# Altium schematic sheet galvo_driver.SchDoc
size A
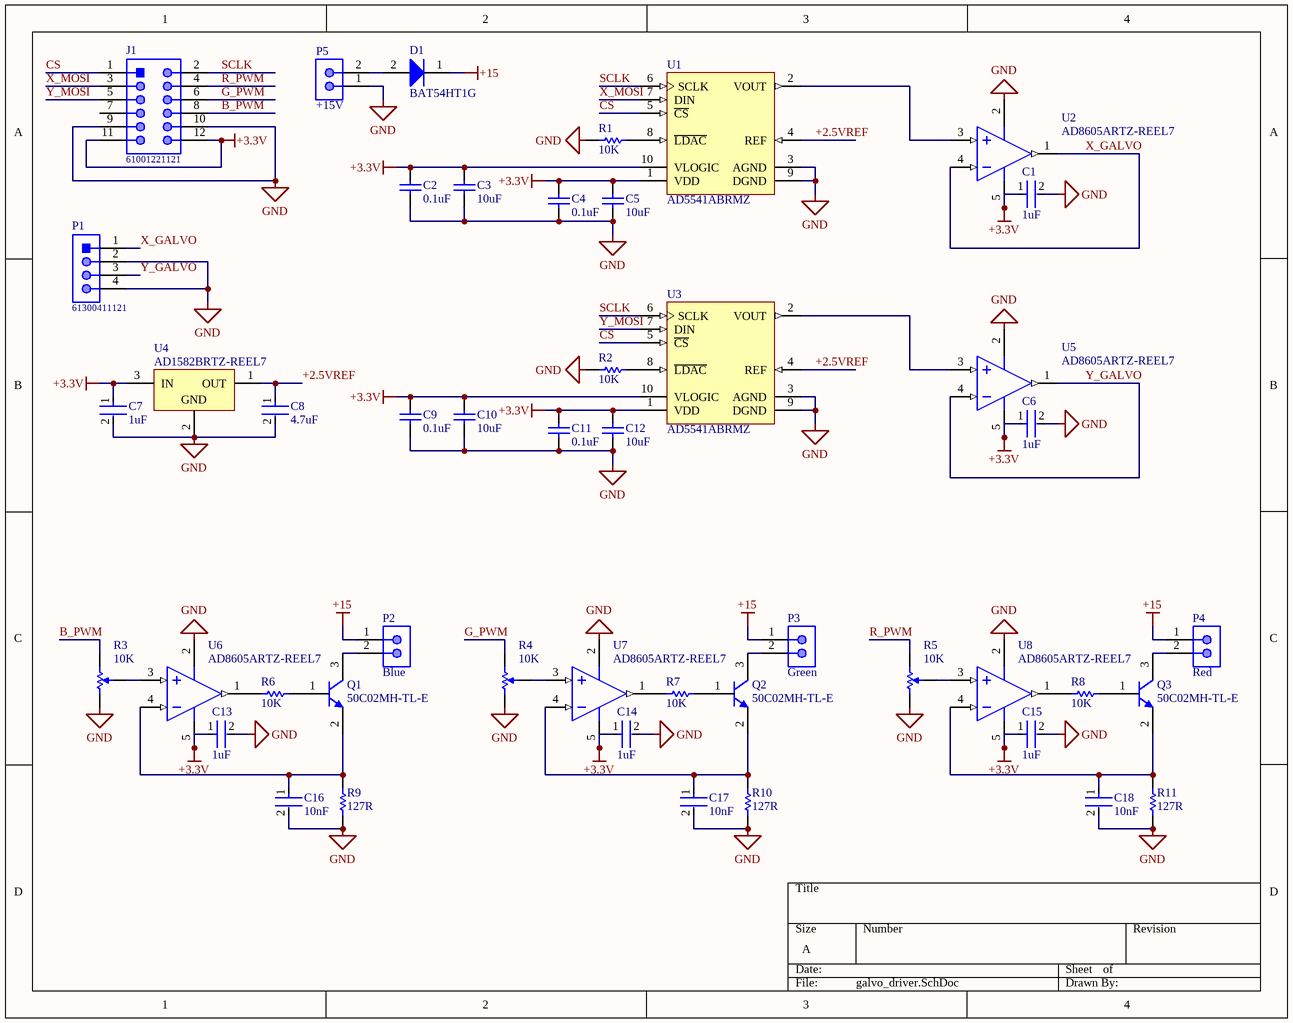
[diagram p0: galvo_driver.SchDoc]

## Parts
C1  1uF  [FP-CC0603-DA-MFG]
C2  0.1uF  [CAPC1608X87X35NL15T15]
C3  10uF  [CAPC1608X90X35NL10T15]
C4  0.1uF  [CAPC1608X87X35NL15T15]
C5  10uF  [CAPC1608X90X35NL10T15]
C6  1uF  [FP-CC0603-DA-MFG]
C7  1uF  [FP-CC0603-DA-MFG]
C8  4.7uF  [FP-C0603-CG-MFG]
C9  0.1uF  [CAPC1608X87X35NL15T15]
C10  10uF  [CAPC1608X90X35NL10T15]
C11  0.1uF  [CAPC1608X87X35NL15T15]
C12  10uF  [CAPC1608X90X35NL10T15]
C13  1uF  [FP-CC0603-DA-MFG]
C14  1uF  [FP-CC0603-DA-MFG]
C15  1uF  [FP-CC0603-DA-MFG]
C16  10nF  [FP-CGA3E-0_3-0_1-IPC_A]
C17  10nF  [FP-CGA3E-0_3-0_1-IPC_A]
C18  10nF  [FP-CGA3E-0_3-0_1-IPC_A]
D1  BAT54HT1G  [ONSC-SOD-323-2-477-02_V]
J1  61001221121  [61001221121]
P1  61300411121  [61300411121]
P2  Blue  [JST-B2B-XH-A_V]
P3  Green  [JST-B2B-XH-A_V]
P4  Red  [JST-B2B-XH-A_V]
P5  +15V  [JST-B2B-XH-A_V]
Q1  50C02MH-TL-E  [ONSC-MCPH-3_V]
Q2  50C02MH-TL-E  [ONSC-MCPH-3_V]
Q3  50C02MH-TL-E  [ONSC-MCPH-3_V]
R1  10K  [RESC1609X55X30LL15T15]
R2  10K  [RESC1609X55X30LL15T15]
R3  10K  [BOUR-3313J-1_V]
R4  10K  [BOUR-3313J-1_V]
R5  10K  [BOUR-3313J-1_V]
R6  10K  [RESC1609X55X30LL15T15]
R7  10K  [RESC1609X55X30LL15T15]
R8  10K  [RESC1609X55X30LL15T15]
R9  127R  [RESC1608X55X30LL15T15]
R10  127R  [RESC1608X55X30LL15T15]
R11  127R  [RESC1608X55X30LL15T15]
U1  AD5541ABRMZ  [RM-10_L]
U2  AD8605ARTZ-REEL7  [ADI-RJ-5_M]
U3  AD5541ABRMZ  [RM-10_L]
U4  AD1582BRTZ-REEL7  [ADI-RT-3_M]
U5  AD8605ARTZ-REEL7  [ADI-RJ-5_M]
U6  AD8605ARTZ-REEL7  [ADI-RJ-5_M]
U7  AD8605ARTZ-REEL7  [ADI-RJ-5_M]
U8  AD8605ARTZ-REEL7  [ADI-RJ-5_M]

## Nets
+3.3V: C1.1 C2.1 C3.2 C4.1 C5.2 C6.1 C7.1 C9.1 C10.2 C11.1 C12.2 C13.1 C14.1 C15.1 J1.11 J1.12 U1.1(VDD) U1.10(VLOGIC) U2.5(+V) U3.1(VDD) U3.10(VLOGIC) U4.3(IN) U5.5(+V) U6.5(+V) U7.5(+V) U8.5(+V)
+15: D1.1(K) P2.1 P3.1 P4.1
GND: C1.2 C2.2 C3.1 C4.2 C5.1 C6.2 C7.2 C8.2 C9.2 C10.1 C11.2 C12.1 C13.2 C14.2 C15.2 C16.2 C17.2 C18.2 J1.9 J1.10 P1.2 P1.4 P5.1 R1.2 R2.2 R3.1 R4.1 R5.1 R9.1 R10.1 R11.1 U1.3(AGND) U1.9(DGND) U2.2(-V) U3.3(AGND) U3.9(DGND) U4.2(GND) U5.2(-V) U6.2(-V) U7.2(-V) U8.2(-V)
+2.5VREF: C8.1 U1.4(REF) U3.4(REF) U4.1(OUT)
B_PWM: J1.8 R3.3
CS: J1.1 U1.5(~{CS}) U3.5(~{CS})
G_PWM: J1.6 R4.3
R_PWM: J1.4 R5.3
SCLK: J1.2 U1.6(SCLK) U3.6(SCLK)
X_GALVO: P1.1 U2.1(OUT) U2.4(-IN)
X_MOSI: J1.3 U1.7(DIN)
Y_GALVO: P1.3 U5.1(OUT) U5.4(-IN)
Y_MOSI: J1.5 U3.7(DIN)
NetC16_1: C16.1 Q1.2(E) R9.2 U6.4(-IN)
NetC17_1: C17.1 Q2.2(E) R10.2 U7.4(-IN)
NetC18_1: C18.1 Q3.2(E) R11.2 U8.4(-IN)
NetD1_2: D1.2(A) P5.2
NetP2_2: P2.2 Q1.3(C)
NetP3_2: P3.2 Q2.3(C)
NetP4_2: P4.2 Q3.3(C)
NetQ1_1: Q1.1(B) R6.2
NetQ2_1: Q2.1(B) R7.2
NetQ3_1: Q3.1(B) R8.2
NetR1_1: R1.1 U1.8(~{LDAC})
NetR2_1: R2.1 U3.8(~{LDAC})
NetR3_2: R3.2 U6.3(+IN)
NetR4_2: R4.2 U7.3(+IN)
NetR5_2: R5.2 U8.3(+IN)
NetR6_1: R6.1 U6.1(OUT)
NetR7_1: R7.1 U7.1(OUT)
NetR8_1: R8.1 U8.1(OUT)
NetU1_2: U1.2(VOUT) U2.3(+IN)
NetU3_2: U3.2(VOUT) U5.3(+IN)

Not connected (* = marked no-connect by the designer): J1 7

## Library data of the parts
C1 C6 C7 C13-C15 = CMP-03422-000924-1: CAP CER 1UF 16V X7R 0603; Manufacturer: YAGEO; Manufacturer Part Number: CC0603KRX7R7BB105; Tolerance: 0.1; Temperature Coefficient: 15%; Material: Ceramic; Package: CC0603-DA; RoHS: TRUE; Device Class L2: Capacitors; Temperature Characteristic: X7R; Temperature: -55°C to +125°C; Temperature Range Low: -55°C; Automotive: No; ComponentLink2Description: Datasheet; Value: 1 uF; Lead Free: Yes; Capacitance: 1 uF; ComponentLink2URL: http://www.yageo.com/documents/recent/UPY-GPHC_X7R_6.3V-to-50V_18.pdf; Device Class L1: Passive Components; Voltage: 16 V; Octopart: https://octopart.com/cc0603krx7r7bb105-yageo-42271928; Category: Cap; Digikey Description: CAP CER 1UF 16V X7R 0603; Footprint Url: http://www.yageo.com/exep/pages/download/literatures/UPY-C_GEN_24.pdf; Height: 0.9mm; Voltage Rating: 16 V; Temperature Range High: +125°C; Mouser Description: Multilayer Ceramic Capacitor, CC Series, 1 - F, - 10%, X7R, 16 V, 0603 [1608 Metric]; Device Class L3: Ceramic Capacitors
C2 C4 C9 C11 = CMP-2006-03300-1: C0603X104K5RACTU; Manufacturer: Kemet; Part Number: C0603X104K5RACTU
C3 C5 C10 C12 = CMP-2006-02792-1: GRM188R60J106ME47D; Manufacturer: Murata; Part Number: GRM188R60J106ME47D
C8 = CMP-03020-024641-1: CAP CER 4.7UF 6.3V X5R 0603; Manufacturer: Kemet; Manufacturer Part Number: C0603C475K9PACTU; Temperature Coefficient: 15%; Tolerance: 10%; Material: Ceramic; Device Class L3: Ceramic Capacitors; RoHS: TRUE; Value: 4.7uF; Lead Free: Yes; ComponentLink2Description: Datasheet; Mouser Description: Multilayer Ceramic Capacitors MLCC - SMD/SMT 6.3volts 4.7uF X5R 10%; Package: C0603-CG; Digikey Description: CAP CER 4.7UF 6.3V X5R 0603; ComponentLink2URL: https://content.kemet.com/datasheets/KEM_C1006_X5R_SMD.pdf; Category: Cap; Temperature Range Low: -55°C; Capacitance: 4.7uF; Temperature: -55°C to +85°C; Octopart: https://octopart.com/c0603c475k9pactu-kemet-104242; Ipc Land Pattern Name: CAPC16080X80; Voltage Rating: 6.3V; Temperature Range High: +85°C; Height: 0.9mm; Temperature Characteristic: X5R; Device Class L1: Passive Components; Automotive: No; Device Class L2: Capacitors
C16-C18 = CMP-08246-000769-1: Cap Ceramic 10nF 100V X8R 10% Pad SMD 0603 +150°C Automotive T/R; Mount: Surface Mount; Voltage Rating (DC): 100V; Termination: SMD/SMT; Dielectric: X8R; Case/Package: 0603; Ratings: AEC-Q200; Voltage Rating: 100V; Capacitance: 10nF; Packaging: Tape and Reel; Thickness: 0.035inch; Composition: Ceramic; Max Operating Temperature: 150°C; Width: 0.031inch; Height: 0.8mm; Weight: 7.1E-05oz; Depth: 0.8mm; Min Operating Temperature: -55°C; Length: 1.6mm; Case Code (Metric): 1608; Tolerance: 10%; Package Quantity: 4000; Case Code (Imperial): 0603
D1 = CMP-1055-00462-1: Schottky Barrier Diode, 2-Pin SOD-323, Pb-Free, Tape and Reel; Manufacturer: On Semiconductor; Configuration: Single; trr Max (ns): 5; IFSM Max (A): 0.6; ComponentLink3URL: http://www.onsemi.com/pub_link/Collateral/477-02.PDF.1; PackageDescription: 2-Pin SOD, Body 1.7 x 1.25 mm; ComponentLink2URL: http://www.onsemi.cn/pub_link/Collateral/BAT54HT1-D.PDF; ComponentLink3Description: Package Specification; ComponentLink2Description: Datasheet; DatasheetVersion: Rev. 6; PackageReference: SOD-323-2-477-02; RoHS: TRUE; ComponentLink1URL: http://www.onsemi.com/; Packing: Tape and Reel; PartNumber: BAT54HT1G; Mounting Technology: Surface Mount; ComponentLink1Description: Manufacturer URL; PackageVersion: Rev. H, 03/2007
J1 = CMP-1502-01029-1: SMT Vertical Pin Header WR-PHD, Pitch 2.54 mm, Dual Row, 12 pins; Manufacturer: Wurth Elektronik; Working Voltage: 250VAC; Pin Number: 12; Withstanding Voltage: 500VAC; Contact Resistance: 20mOhm; Rated Current: 3A; Gender: Male; Pitch: 2.54mm; Publisher: WurthElektronik; Packaging: Tube; Part Number: 61001221121; Row Number: Dual; Mounting Technology: SMT; Manufacturer URL: http://www.we-online.de; Operating Temperature: -40to125degC; Datasheet URL: https://katalog.we-online.de/em/datasheet/6100xx21121.pdf; Orientation: Vertical; Package Reference: 61001221121
P1 = CMP-1502-01064-1: THT Vertical Pin Header WR-PHD, Pitch 2.54 mm, Single Row, 4 pins; Manufacturer: Wurth Elektronik; Withstanding Voltage: 500VAC; Rated Current: 3A; Working Voltage: 250VAC; Pin Number: 4; Gender: Male; Contact Resistance: 20mOhm; Pitch: 2.54mm; Manufacturer URL: http://www.we-online.de; Operating Temperature: -40to105degC; Packaging: Bag; Mounting Technology: THT; Package Reference: 61300411121; Datasheet URL: https://katalog.we-online.de/em/datasheet/6130xx11121.pdf; Publisher: WurthElektronik; Part Number: 61300411121; Row Number: Single; Orientation: Vertical
P2-P5 = CMP-2000-05888-1: Male Header, Pitch 2.5 mm, 1 x 2 Position, Height 7 mm, Tail Length 3.4 mm, -25 to 85 degC, RoHS, Bulk; Manufacturer: JST; No of Positions: 2; Pitch: 2.5mm; Style/Orientation: StraightHeader/Plug; Datasheet Version: 05/2016; Package Description: Male Header, Pitch 2.5 mm, 1 x 2 Position, Height 7 mm, Tail Length 3.4 mm; Package Reference: B2B-XH-A; Mounting Technology: ThroughHole; Type: ShroudedHeader; Datasheet URL: http://www.jst-mfg.com/product/pdf/eng/eXH.pdf; Manufacturer URL: http://www.jst.com/home2.html; Termination: Crimp
Q1-Q3 = CMP-1048-00258-1: Bipolar Transistor, 50 V, 0.5 A, Low VCE(sat), NPN Single, 3-Pin MCPH, Pb-Free, Tape and Reel; Manufacturer: On Semiconductor; IC Continuous (A): 0.5; RoHS: TRUE; PackageDescription: 3-Pin Small Outline Transistor, Body 2 x 1.6 mm, Pitch 0.65 mm; ComponentLink2Description: Datasheet; Mounting Technology: Surface Mount; ComponentLink1URL: http://www.onsemi.com/; PartNumber: 50C02MH-TL-E; Packing: Tape and Reel; ComponentLink2URL: http://www.onsemi.com/pub_link/Collateral/50C02MH-D.PDF; ComponentLink3Description: Package Specification; ComponentLink3URL: http://www.onsemi.com/pub_link/Collateral/EN7354-D.PDF; PackageReference: MCPH-3; Polarity: NPN; ComponentLink1Description: Manufacturer URL
R1 R2 R6-R8 = CMP-2000-07452-1: Chip Resistor, 10 KOhm, +/- 1%, 0.1 W, -55 to 155 degC, 0603 (1608 Metric), RoHS, Tape and Reel; Manufacturer: Panasonic; Voltage Rating: 75V; Case\/Package: 0603; Power Rating: 100mW; Resistance: 10KOhm; Temperature Coefficient: 100ppm\/degreesC; Number of Pins: 2; Package Reference: 603; Depth: 0.8mm; Mount: SurfaceMount; Package Description: 2-Pin Surface Mount Device, Body 1.6 x 0.85 mm; Datasheet Version: 02/2017; Length: 1.6mm; Lead Free: LeadFree; Height: 0.45mm; Number of Terminations: 2; Max Power Dissipation: 100mW; Min Operating Temperature: -55degC; Datasheet URL: https://industrial.panasonic.com/cdbs/www-data/pdf/RDA0000/AOA0000C304.pdf; Termination: SMD/SMT; Case Code (Metric): 1608; Case Code (Imperial): 0603; Tolerance: 1%; Max Operating Temperature: 155degC; RoHSCompliant: true; Voltage Rating (DC): 75V; Radiation Hardening: No; Packaging: TapeandReel; Composition: ThickFilm; Mounting Technology: SurfaceMount; Manufacturer URL: http://www.panasonic.com/; Width: 0.031inch; REACH SVHC: NoSVHC; Contact Plating: Tin; Military Standard: Not; Package Quantity: 1
R3-R5 = CMP-2000-05585-1: Trimming Potentiometer, 10 KOhm, -55 to 125 degC, 3-Pin SMD, RoHS, Tape and Reel; Manufacturer: Bourns; Resistance Tolerance: ±20%; Track Resistance: 10kohm; SVHC: NoSVHC(16-Jun-2014); No. of Turns: 1; Temperature Coefficient: ±100ppm/°C; Power Rating: 125mW; Potentiometer Mounting: SMD; RoHS Compliant: Yes; Datasheet URL: http://www.bourns.com/docs/Product-Datasheets/3313.pdf; Mounting Technology: SurfaceMount; Manufacturer URL: http://www.bourns.com/; Package Description: 3-Pin Surface Mount Device, Body 3.5 x 3.2 mm, Pitch 1.15 mm; Package Reference: 3313J-1; Datasheet Version: 05/2016
R9-R11 = CMP-2000-00226-1: ERJ-3EKF1270V; Manufacturer: Panasonic; Part Number: ERJ-3EKF1270V
U1 U3 = CMP-0318-02105-2: Single 16-Bit Voltage Output Digital-to-Analog Converter with Serial Interface, 2.7 to 5.5 V, -40 to +125 degC, RM-10, Pb-Free, Tube; Manufacturer: Analog Devices; Op Pwr Diss: 600ÂµW; Settling Time: 1Âµs; Max V+: 5.5V; Resolution (Bits): 16; Single Supply: Yes; # DAC Outputs: 1; ComponentLink2Description: Datasheet; ComponentLink2URL: http://www.analog.com/static/imported-files/data_sheets/AD5541A.pdf; RevisionNote: Component URL fixed; PartNumber: AD5541ABRMZ; RoHS: Y; DatasheetVersion: Rev.A; Packing: Tube; ComponentLink4URL: http://www.analog.com/en/digital-to-analog-converters/da-converters/ad5541a/products/product.html; ComponentLink3Description: Package Specification; ComponentLink4Description: Product URL; PackageVersion: May-2005; ComponentLink1URL: http://www.analog.com/en/index.html; Mounting Technology: Surface Mount; PackageReference: RM-10; ComponentLink1Description: Manufacturer URL; ComponentLink3URL: http://www.analog.com/static/imported-files/packages/PKG_PDF/MSOP%28RM%29/RM_10.pdf; Generic Part Number: AD5541A; PackageDescription: 10-Lead Mini Small Outline Package [MSOP]
U2 U5-U8 = CMP-0384-01494-2: Single Channel Wide Bandwidth Operational Amplifier, 10 MHz BW, 5 V/us SR, Industrial, 5-pin SOT23 (RJ-5), Reel; Manufacturer: Analog Devices; Generic Part Number: AD8605; Input Offset Voltage: 20uV; V Span Min: 2.7V; Input Bias Current: 200fA; Slew Rate: 5V/us; V Span Max: 6V; Small Signal Bandwidth: 10MHz; Amplifiers Per Package: 1; Iq/Amp: 1.2mA; ComponentLink2Description: Datasheet; PackageVersion: 121608-A; Mounting Technology: Surface Mount; ComponentLink3URL: http://www.analog.com/static/imported-files/packages/PKG_PDF/SOT-23(RJ)/RJ_5.pdf; Code_JEDEC: MO-178-AA; ComponentLink1Description: Manufacturer URL; ComponentLink4Description: Reference Circuit; RevisionNote: Reference Circuit URL fixed; PartNumber: AD8605ARTZ-REEL7; DatasheetVersion: Rev. L; PackageDescription: 5-Pin Small Outline Transistor Package, Body 2.9 x 1.6 mm, Pitch 0.95 mm; ComponentLink4URL: http://www.analog.com/en/all-operational-amplifiers-op-amps/operational-amplifiers-op-amps/ad8605/products/product.html#product-recommendations; ComponentLink3Description: Package Specification; ComponentLink1URL: http://www.analog.com/en/index.html; PackageReference: RJ-5; ComponentLink2URL: http://www.analog.com/static/imported-files/data_sheets/AD8605_8606_8608.pdf
U4 = CMP-0784-00464-1: Micropower, Precision Series Mode Voltage Reference, 2.5 V Output, 2.7 to 12 V Supply, Industrial, 3-pin SOT23 (RT-3), Reel; Manufacturer: Analog Devices; Vout: 2.5V; Ref Out TC (ppm/C): 18; ComponentLink2URL: http://www.analog.com/static/imported-files/data_sheets/AD1582_1583_1584_1585.pdf; DatasheetVersion: Rev. I; Mounting Technology: Surface Mount; Packing: Reel; PackageDescription: 3-Pin Small Outline Transistor Package, Body 2.9 x 1.3 mm, Pitch 0.96 mm; ComponentLink3Description: Package Specification; PackageVersion: 011909-C, 02/2009; ComponentLink4Description: URL Link1; PackageReference: RT-3; ComponentLink1URL: http://www.analog.com/en/index.html; PartNumber: AD1582BRTZ-REEL7; ComponentLink1Description: Manufacturer URL; ComponentLink2Description: Datasheet; ComponentLink4URL: Product URL:http://www.analog.com/en/special-linear-functions/voltage-references/ad1582/products/product.html; Operating Temp Range: -40 to 125 degC; Code_JEDEC: TO-236-AB; ComponentLink3URL: http:/www.analog.com/static/imported-files/packages/PKG_PDF/SOT-23-3 (RT)/RT_3.pdf